# Altium schematic sheet Keys.SchDoc
size A3
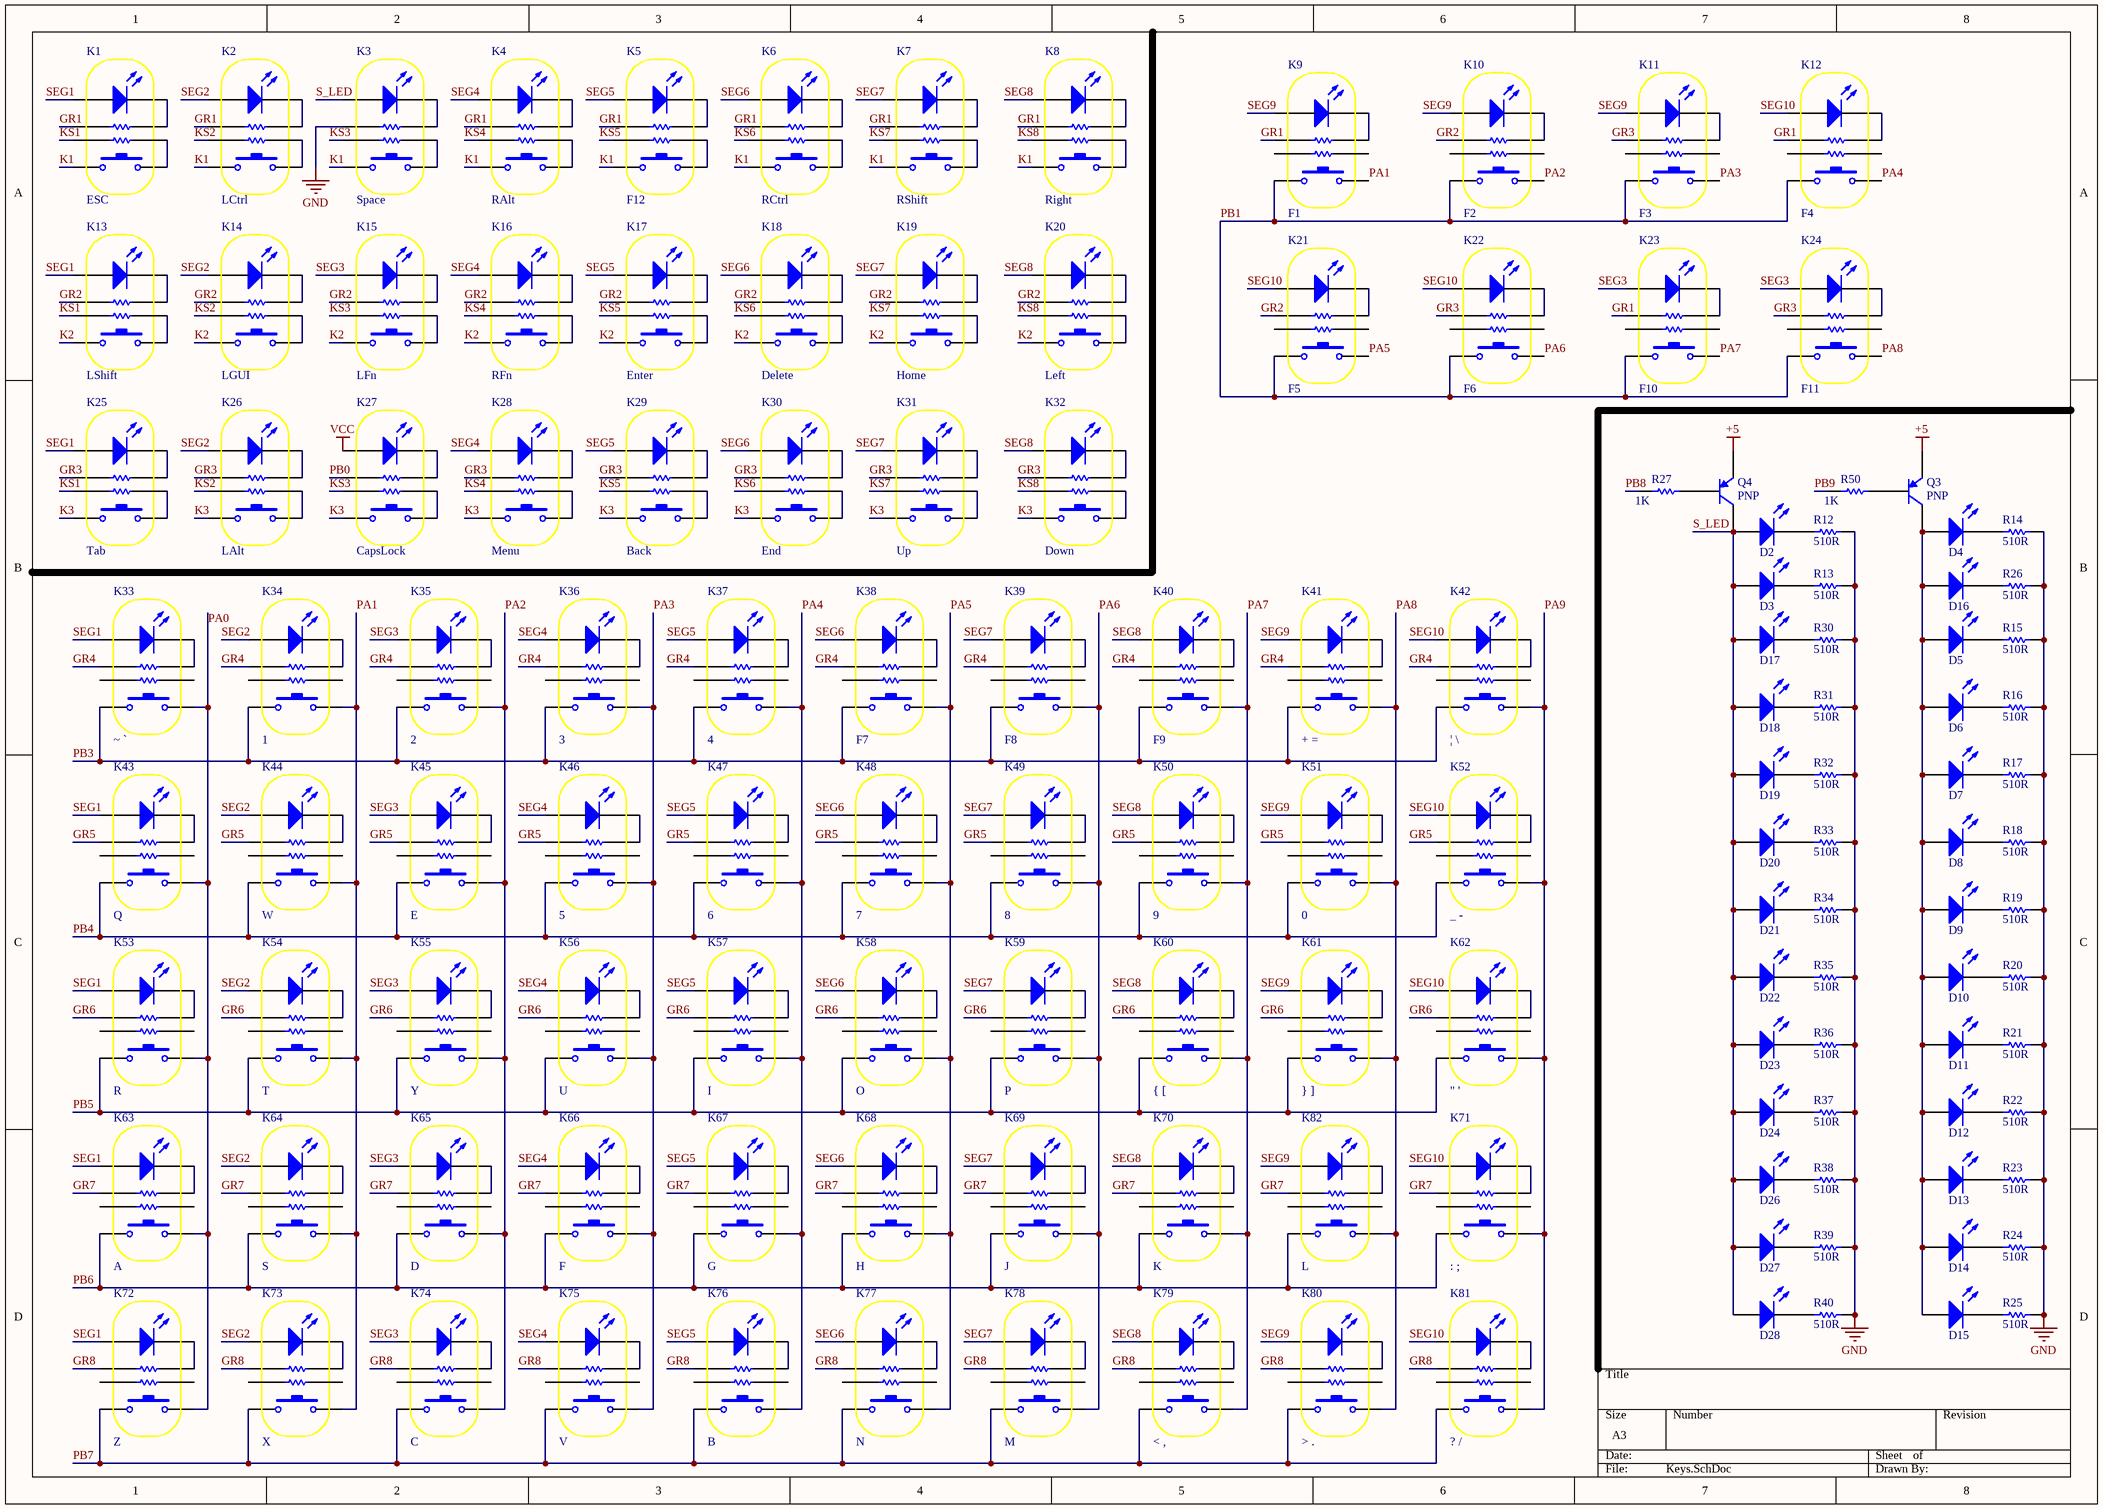
[diagram p0: Keys.SchDoc]

## Parts
D2  LED  [LC-0603_LED_S3]  (value not drawn)
D3  LED  [LC-0603_LED_S3]  (value not drawn)
D4  LED  [LC-0603_LED_S3]  (value not drawn)
D5  LED  [LC-0603_LED_S3]  (value not drawn)
D6  LED  [LC-0603_LED_S3]  (value not drawn)
D7  LED  [LC-0603_LED_S3]  (value not drawn)
D8  LED  [LC-0603_LED_S3]  (value not drawn)
D9  LED  [LC-0603_LED_S3]  (value not drawn)
D10  LED  [LC-0603_LED_S3]  (value not drawn)
D11  LED  [LC-0603_LED_S3]  (value not drawn)
D12  LED  [LC-0603_LED_S3]  (value not drawn)
D13  LED  [LC-0603_LED_S3]  (value not drawn)
D14  LED  [LC-0603_LED_S3]  (value not drawn)
D15  LED  [LC-0603_LED_S3]  (value not drawn)
D16  LED  [LC-0603_LED_S3]  (value not drawn)
D17  LED  [LC-0603_LED_S3]  (value not drawn)
D18  LED  [LC-0603_LED_S3]  (value not drawn)
D19  LED  [LC-0603_LED_S3]  (value not drawn)
D20  LED  [LC-0603_LED_S3]  (value not drawn)
D21  LED  [LC-0603_LED_S3]  (value not drawn)
D22  LED  [LC-0603_LED_S3]  (value not drawn)
D23  LED  [LC-0603_LED_S3]  (value not drawn)
D24  LED  [LC-0603_LED_S3]  (value not drawn)
D26  LED  [LC-0603_LED_S3]  (value not drawn)
D27  LED  [LC-0603_LED_S3]  (value not drawn)
D28  LED  [LC-0603_LED_S3]  (value not drawn)
K1  ESC  [Key]
K2  LCtrl  [Key]
K3  Space  [Key]
K4  RAlt  [Key]
K5  F12  [Key]
K6  RCtrl  [Key]
K7  RShift  [Key]
K8  Right  [Key]
K9  F1  [Key]
K10  F2  [Key]
K11  F3  [Key]
K12  F4  [Key]
K13  LShift  [Key]
K14  LGUI  [Key]
K15  LFn  [Key]
K16  RFn  [Key]
K17  Enter  [Key]
K18  Delete  [Key]
K19  Home  [Key]
K20  Left  [Key]
K21  F5  [Key]
K22  F6  [Key]
K23  F10  [Key]
K24  F11  [Key]
K25  Tab  [Key]
K26  LAlt  [Key]
K27  CapsLock  [Key]
K28  Menu  [Key]
K29  Back  [Key]
K30  End  [Key]
K31  Up  [Key]
K32  Down  [Key]
K33  ~ `  [Key]
K34  1  [Key]
K35  2  [Key]
K36  3  [Key]
K37  4  [Key]
K38  F7  [Key]
K39  F8  [Key]
K40  F9  [Key]
K41  + =  [Key]
K42  | \  [Key]
K43  Q  [Key]
K44  W  [Key]
K45  E  [Key]
K46  5  [Key]
K47  6  [Key]
K48  7  [Key]
K49  8  [Key]
K50  9  [Key]
K51  0  [Key]
K52  _ -  [Key]
K53  R  [Key]
K54  T  [Key]
K55  Y  [Key]
K56  U  [Key]
K57  I  [Key]
K58  O  [Key]
K59  P  [Key]
K60  { [  [Key]
K61  } ]  [Key]
K62  " '  [Key]
K63  A  [Key]
K64  S  [Key]
K65  D  [Key]
K66  F  [Key]
K67  G  [Key]
K68  H  [Key]
K69  J  [Key]
K70  K  [Key]
K71  : ;  [Key]
K72  Z  [Key]
K73  X  [Key]
K74  C  [Key]
K75  V  [Key]
K76  B  [Key]
K77  N  [Key]
K78  M  [Key]
K79  < ,  [Key]
K80  > .  [Key]
K81  ? /  [Key]
K82  L  [Key]
Q3  PNP  [LC-SOT-23(SOT-23-3)]
Q4  PNP  [LC-SOT-23(SOT-23-3)]
R12  510R  [LC-0603_R]
R13  510R  [LC-0603_R]
R14  510R  [LC-0603_R]
R15  510R  [LC-0603_R]
R16  510R  [LC-0603_R]
R17  510R  [LC-0603_R]
R18  510R  [LC-0603_R]
R19  510R  [LC-0603_R]
R20  510R  [LC-0603_R]
R21  510R  [LC-0603_R]
R22  510R  [LC-0603_R]
R23  510R  [LC-0603_R]
R24  510R  [LC-0603_R]
R25  510R  [LC-0603_R]
R26  510R  [LC-0603_R]
R27  1K  [LC-0603_R]
R30  510R  [LC-0603_R]
R31  510R  [LC-0603_R]
R32  510R  [LC-0603_R]
R33  510R  [LC-0603_R]
R34  510R  [LC-0603_R]
R35  510R  [LC-0603_R]
R36  510R  [LC-0603_R]
R37  510R  [LC-0603_R]
R38  510R  [LC-0603_R]
R39  510R  [LC-0603_R]
R40  510R  [LC-0603_R]
R50  1K  [LC-0603_R]

## Nets
+5: Q3.3(E) Q4.3(E)
GND: K3.2(K) R12.2 R13.2 R14.2 R15.2 R16.2 R17.2 R18.2 R19.2 R20.2 R21.2 R22.2 R23.2 R24.2 R25.2 R26.2 R30.2 R31.2 R32.2 R33.2 R34.2 R35.2 R36.2 R37.2 R38.2 R39.2 R40.2
VCC: K27.1(A)
GR1: K1.2(K) K2.2(K) K4.2(K) K5.2(K) K6.2(K) K7.2(K) K8.2(K) K9.2(K) K12.2(K) K23.2(K)
GR2: K10.2(K) K13.2(K) K14.2(K) K15.2(K) K16.2(K) K17.2(K) K18.2(K) K19.2(K) K20.2(K) K21.2(K)
GR3: K11.2(K) K22.2(K) K24.2(K) K25.2(K) K26.2(K) K28.2(K) K29.2(K) K30.2(K) K31.2(K) K32.2(K)
GR4: K33.2(K) K34.2(K) K35.2(K) K36.2(K) K37.2(K) K38.2(K) K39.2(K) K40.2(K) K41.2(K) K42.2(K)
GR5: K43.2(K) K44.2(K) K45.2(K) K46.2(K) K47.2(K) K48.2(K) K49.2(K) K50.2(K) K51.2(K) K52.2(K)
GR6: K53.2(K) K54.2(K) K55.2(K) K56.2(K) K57.2(K) K58.2(K) K59.2(K) K60.2(K) K61.2(K) K62.2(K)
GR7: K63.2(K) K64.2(K) K65.2(K) K66.2(K) K67.2(K) K68.2(K) K69.2(K) K70.2(K) K71.2(K) K82.2(K)
GR8: K72.2(K) K73.2(K) K74.2(K) K75.2(K) K76.2(K) K77.2(K) K78.2(K) K79.2(K) K80.2(K) K81.2(K)
K1: K1.4 K2.4 K3.4 K4.4 K5.4 K6.4 K7.4 K8.4
K2: K13.4 K14.4 K15.4 K16.4 K17.4 K18.4 K19.4 K20.4
K3: K25.4 K26.4 K27.4 K28.4 K29.4 K30.4 K31.4 K32.4
KS1: K1.3(A) K13.3(A) K25.3(A)
KS2: K2.3(A) K14.3(A) K26.3(A)
KS3: K3.3(A) K15.3(A) K27.3(A)
KS4: K4.3(A) K16.3(A) K28.3(A)
KS5: K5.3(A) K17.3(A) K29.3(A)
KS6: K6.3(A) K18.3(A) K30.3(A)
KS7: K7.3(A) K19.3(A) K31.3(A)
KS8: K8.3(A) K20.3(A) K32.3(A)
PA0: K33.5 K43.5 K53.5 K63.5 K72.5
PA1: K9.5 K34.5 K44.5 K54.5 K64.5 K73.5
PA2: K10.5 K35.5 K45.5 K55.5 K65.5 K74.5
PA3: K11.5 K36.5 K46.5 K56.5 K66.5 K75.5
PA4: K12.5 K37.5 K47.5 K57.5 K67.5 K76.5
PA5: K21.5 K38.5 K48.5 K58.5 K68.5 K77.5
PA6: K22.5 K39.5 K49.5 K59.5 K69.5 K78.5
PA7: K23.5 K40.5 K50.5 K60.5 K70.5 K79.5
PA8: K24.5 K41.5 K51.5 K61.5 K80.5 K82.5
PA9: K42.5 K52.5 K62.5 K71.5 K81.5
PB0: K27.2(K)
PB1: K9.4 K10.4 K11.4 K12.4 K21.4 K22.4 K23.4 K24.4
PB3: K33.4 K34.4 K35.4 K36.4 K37.4 K38.4 K39.4 K40.4 K41.4 K42.4
PB4: K43.4 K44.4 K45.4 K46.4 K47.4 K48.4 K49.4 K50.4 K51.4 K52.4
PB5: K53.4 K54.4 K55.4 K56.4 K57.4 K58.4 K59.4 K60.4 K61.4 K62.4
PB6: K63.4 K64.4 K65.4 K66.4 K67.4 K68.4 K69.4 K70.4 K71.4 K82.4
PB7: K72.4 K73.4 K74.4 K75.4 K76.4 K77.4 K78.4 K79.4 K80.4 K81.4
PB8: R27.1
PB9: R50.1
S_LED: D2.A D3.A D17.A D18.A D19.A D20.A D21.A D22.A D23.A D24.A D26.A D27.A D28.A K3.1(A) Q4.1(C)
SEG1: K1.1(A) K13.1(A) K25.1(A) K33.1(A) K43.1(A) K53.1(A) K63.1(A) K72.1(A)
SEG2: K2.1(A) K14.1(A) K26.1(A) K34.1(A) K44.1(A) K54.1(A) K64.1(A) K73.1(A)
SEG3: K15.1(A) K23.1(A) K24.1(A) K35.1(A) K45.1(A) K55.1(A) K65.1(A) K74.1(A)
SEG4: K4.1(A) K16.1(A) K28.1(A) K36.1(A) K46.1(A) K56.1(A) K66.1(A) K75.1(A)
SEG5: K5.1(A) K17.1(A) K29.1(A) K37.1(A) K47.1(A) K57.1(A) K67.1(A) K76.1(A)
SEG6: K6.1(A) K18.1(A) K30.1(A) K38.1(A) K48.1(A) K58.1(A) K68.1(A) K77.1(A)
SEG7: K7.1(A) K19.1(A) K31.1(A) K39.1(A) K49.1(A) K59.1(A) K69.1(A) K78.1(A)
SEG8: K8.1(A) K20.1(A) K32.1(A) K40.1(A) K50.1(A) K60.1(A) K70.1(A) K79.1(A)
SEG9: K9.1(A) K10.1(A) K11.1(A) K41.1(A) K51.1(A) K61.1(A) K80.1(A) K82.1(A)
SEG10: K12.1(A) K21.1(A) K22.1(A) K42.1(A) K52.1(A) K62.1(A) K71.1(A) K81.1(A)
NetD2_K: D2.K R12.1
NetD3_K: D3.K R13.1
NetD4_A: D4.A D5.A D6.A D7.A D8.A D9.A D10.A D11.A D12.A D13.A D14.A D15.A D16.A Q3.1(C)
NetD4_K: D4.K R14.1
NetD5_K: D5.K R15.1
NetD6_K: D6.K R16.1
NetD7_K: D7.K R17.1
NetD8_K: D8.K R18.1
NetD9_K: D9.K R19.1
NetD10_K: D10.K R20.1
NetD11_K: D11.K R21.1
NetD12_K: D12.K R22.1
NetD13_K: D13.K R23.1
NetD14_K: D14.K R24.1
NetD15_K: D15.K R25.1
NetD16_K: D16.K R26.1
NetD17_K: D17.K R30.1
NetD18_K: D18.K R31.1
NetD19_K: D19.K R32.1
NetD20_K: D20.K R33.1
NetD21_K: D21.K R34.1
NetD22_K: D22.K R35.1
NetD23_K: D23.K R36.1
NetD24_K: D24.K R37.1
NetD26_K: D26.K R38.1
NetD27_K: D27.K R39.1
NetD28_K: D28.K R40.1
NetK1_5: K1.5 K1.6(K)
NetK1_7: K1.7(K) K1.8(K)
NetK2_5: K2.5 K2.6(K)
NetK2_7: K2.7(K) K2.8(K)
NetK3_5: K3.5 K3.6(K)
NetK3_7: K3.7(K) K3.8(K)
NetK4_5: K4.5 K4.6(K)
NetK4_7: K4.7(K) K4.8(K)
NetK5_5: K5.5 K5.6(K)
NetK5_7: K5.7(K) K5.8(K)
NetK6_5: K6.5 K6.6(K)
NetK6_7: K6.7(K) K6.8(K)
NetK7_5: K7.5 K7.6(K)
NetK7_7: K7.7(K) K7.8(K)
NetK8_5: K8.5 K8.6(K)
NetK8_7: K8.7(K) K8.8(K)
NetK9_7: K9.7(K) K9.8(K)
NetK10_7: K10.7(K) K10.8(K)
NetK11_7: K11.7(K) K11.8(K)
NetK12_7: K12.7(K) K12.8(K)
NetK13_5: K13.5 K13.6(K)
NetK13_7: K13.7(K) K13.8(K)
NetK14_5: K14.5 K14.6(K)
NetK14_7: K14.7(K) K14.8(K)
NetK15_5: K15.5 K15.6(K)
NetK15_7: K15.7(K) K15.8(K)
NetK16_5: K16.5 K16.6(K)
NetK16_7: K16.7(K) K16.8(K)
NetK17_5: K17.5 K17.6(K)
NetK17_7: K17.7(K) K17.8(K)
NetK18_5: K18.5 K18.6(K)
NetK18_7: K18.7(K) K18.8(K)
NetK19_5: K19.5 K19.6(K)
NetK19_7: K19.7(K) K19.8(K)
NetK20_5: K20.5 K20.6(K)
NetK20_7: K20.7(K) K20.8(K)
NetK21_7: K21.7(K) K21.8(K)
NetK22_7: K22.7(K) K22.8(K)
NetK23_7: K23.7(K) K23.8(K)
NetK24_7: K24.7(K) K24.8(K)
NetK25_5: K25.5 K25.6(K)
NetK25_7: K25.7(K) K25.8(K)
NetK26_5: K26.5 K26.6(K)
NetK26_7: K26.7(K) K26.8(K)
NetK27_5: K27.5 K27.6(K)
NetK27_7: K27.7(K) K27.8(K)
NetK28_5: K28.5 K28.6(K)
NetK28_7: K28.7(K) K28.8(K)
NetK29_5: K29.5 K29.6(K)
NetK29_7: K29.7(K) K29.8(K)
NetK30_5: K30.5 K30.6(K)
NetK30_7: K30.7(K) K30.8(K)
NetK31_5: K31.5 K31.6(K)
NetK31_7: K31.7(K) K31.8(K)
NetK32_5: K32.5 K32.6(K)
NetK32_7: K32.7(K) K32.8(K)
NetK33_7: K33.7(K) K33.8(K)
NetK34_7: K34.7(K) K34.8(K)
NetK35_7: K35.7(K) K35.8(K)
NetK36_7: K36.7(K) K36.8(K)
NetK37_7: K37.7(K) K37.8(K)
NetK38_7: K38.7(K) K38.8(K)
NetK39_7: K39.7(K) K39.8(K)
NetK40_7: K40.7(K) K40.8(K)
NetK41_7: K41.7(K) K41.8(K)
NetK42_7: K42.7(K) K42.8(K)
NetK43_7: K43.7(K) K43.8(K)
NetK44_7: K44.7(K) K44.8(K)
NetK45_7: K45.7(K) K45.8(K)
NetK46_7: K46.7(K) K46.8(K)
NetK47_7: K47.7(K) K47.8(K)
NetK48_7: K48.7(K) K48.8(K)
NetK49_7: K49.7(K) K49.8(K)
NetK50_7: K50.7(K) K50.8(K)
NetK51_7: K51.7(K) K51.8(K)
NetK52_7: K52.7(K) K52.8(K)
NetK53_7: K53.7(K) K53.8(K)
NetK54_7: K54.7(K) K54.8(K)
NetK55_7: K55.7(K) K55.8(K)
NetK56_7: K56.7(K) K56.8(K)
NetK57_7: K57.7(K) K57.8(K)
NetK58_7: K58.7(K) K58.8(K)
NetK59_7: K59.7(K) K59.8(K)
NetK60_7: K60.7(K) K60.8(K)
NetK61_7: K61.7(K) K61.8(K)
NetK62_7: K62.7(K) K62.8(K)
NetK63_7: K63.7(K) K63.8(K)
NetK64_7: K64.7(K) K64.8(K)
NetK65_7: K65.7(K) K65.8(K)
NetK66_7: K66.7(K) K66.8(K)
NetK67_7: K67.7(K) K67.8(K)
NetK68_7: K68.7(K) K68.8(K)
NetK69_7: K69.7(K) K69.8(K)
NetK70_7: K70.7(K) K70.8(K)
NetK71_7: K71.7(K) K71.8(K)
NetK72_7: K72.7(K) K72.8(K)
NetK73_7: K73.7(K) K73.8(K)
NetK74_7: K74.7(K) K74.8(K)
NetK75_7: K75.7(K) K75.8(K)
NetK76_7: K76.7(K) K76.8(K)
NetK77_7: K77.7(K) K77.8(K)
NetK78_7: K78.7(K) K78.8(K)
NetK79_7: K79.7(K) K79.8(K)
NetK80_7: K80.7(K) K80.8(K)
NetK81_7: K81.7(K) K81.8(K)
NetK82_7: K82.7(K) K82.8(K)
NetQ3_2: Q3.2(B) R50.2
NetQ4_2: Q4.2(B) R27.2

Not connected (* = marked no-connect by the designer): K9 3(A) 6(K); K10 3(A) 6(K); K11 3(A) 6(K); K12 3(A) 6(K); K21 3(A) 6(K); K22 3(A) 6(K); K23 3(A) 6(K); K24 3(A) 6(K); K33 3(A) 6(K); K34 3(A) 6(K); K35 3(A) 6(K); K36 3(A) 6(K); K37 3(A) 6(K); K38 3(A) 6(K); K39 3(A) 6(K); K40 3(A) 6(K); K41 3(A) 6(K); K42 3(A) 6(K); K43 3(A) 6(K); K44 3(A) 6(K); K45 3(A) 6(K); K46 3(A) 6(K); K47 3(A) 6(K); K48 3(A) 6(K); K49 3(A) 6(K); K50 3(A) 6(K); K51 3(A) 6(K); K52 3(A) 6(K); K53 3(A) 6(K); K54 3(A) 6(K); K55 3(A) 6(K); K56 3(A) 6(K); K57 3(A) 6(K); K58 3(A) 6(K); K59 3(A) 6(K); K60 3(A) 6(K); K61 3(A) 6(K); K62 3(A) 6(K); K63 3(A) 6(K); K64 3(A) 6(K); K65 3(A) 6(K); K66 3(A) 6(K); K67 3(A) 6(K); K68 3(A) 6(K); K69 3(A) 6(K); K70 3(A) 6(K); K71 3(A) 6(K); K72 3(A) 6(K); K73 3(A) 6(K); K74 3(A) 6(K); K75 3(A) 6(K); K76 3(A) 6(K); K77 3(A) 6(K); K78 3(A) 6(K); K79 3(A) 6(K); K80 3(A) 6(K); K81 3(A) 6(K); K82 3(A) 6(K)

## Library data of the parts
D2-D24 D26-D28 = LED: Typical INFRARED GaAs LED; Published: 8-Jun-2000; LatestRevisionDate: 08-Jul-2005; LatestRevisionNote: Mech Layer 1 removed.; PackageReference: LED-0; Publisher: Altium Limited; PackageDescription: LED; 2 Leads
K1-K82 = Key: 510R
Q3 Q4 = PNP: PNP Bipolar Transistor; Published: 8-Jun-2000; LatestRevisionDate: 29-May-2009; LatestRevisionNote: IPC-7351 Footprint Added.; PackageVersion: Aug-1999; PackageReference: SOT-23B; Publisher: Altium Limited; PackageDescription: 3-Pin SOT-23 Package 0.95 mm Pitch, 2.4 mm Lead Span
R12-R27 R30-R40 R50 = Resistor: Value: 150R; Published: 8-Jun-2000; LatestRevisionDate: 17-Jul-2002; LatestRevisionNote: Re-released for DXP Platform.; PackageReference: AXIAL-0.3; Publisher: Altium Limited; PackageDescription: Axial Device, Thru-Hole; 2 Leads; 0.3 in Pin Spacing